# EAGLE design turntable (EAGLE 9.6.0)
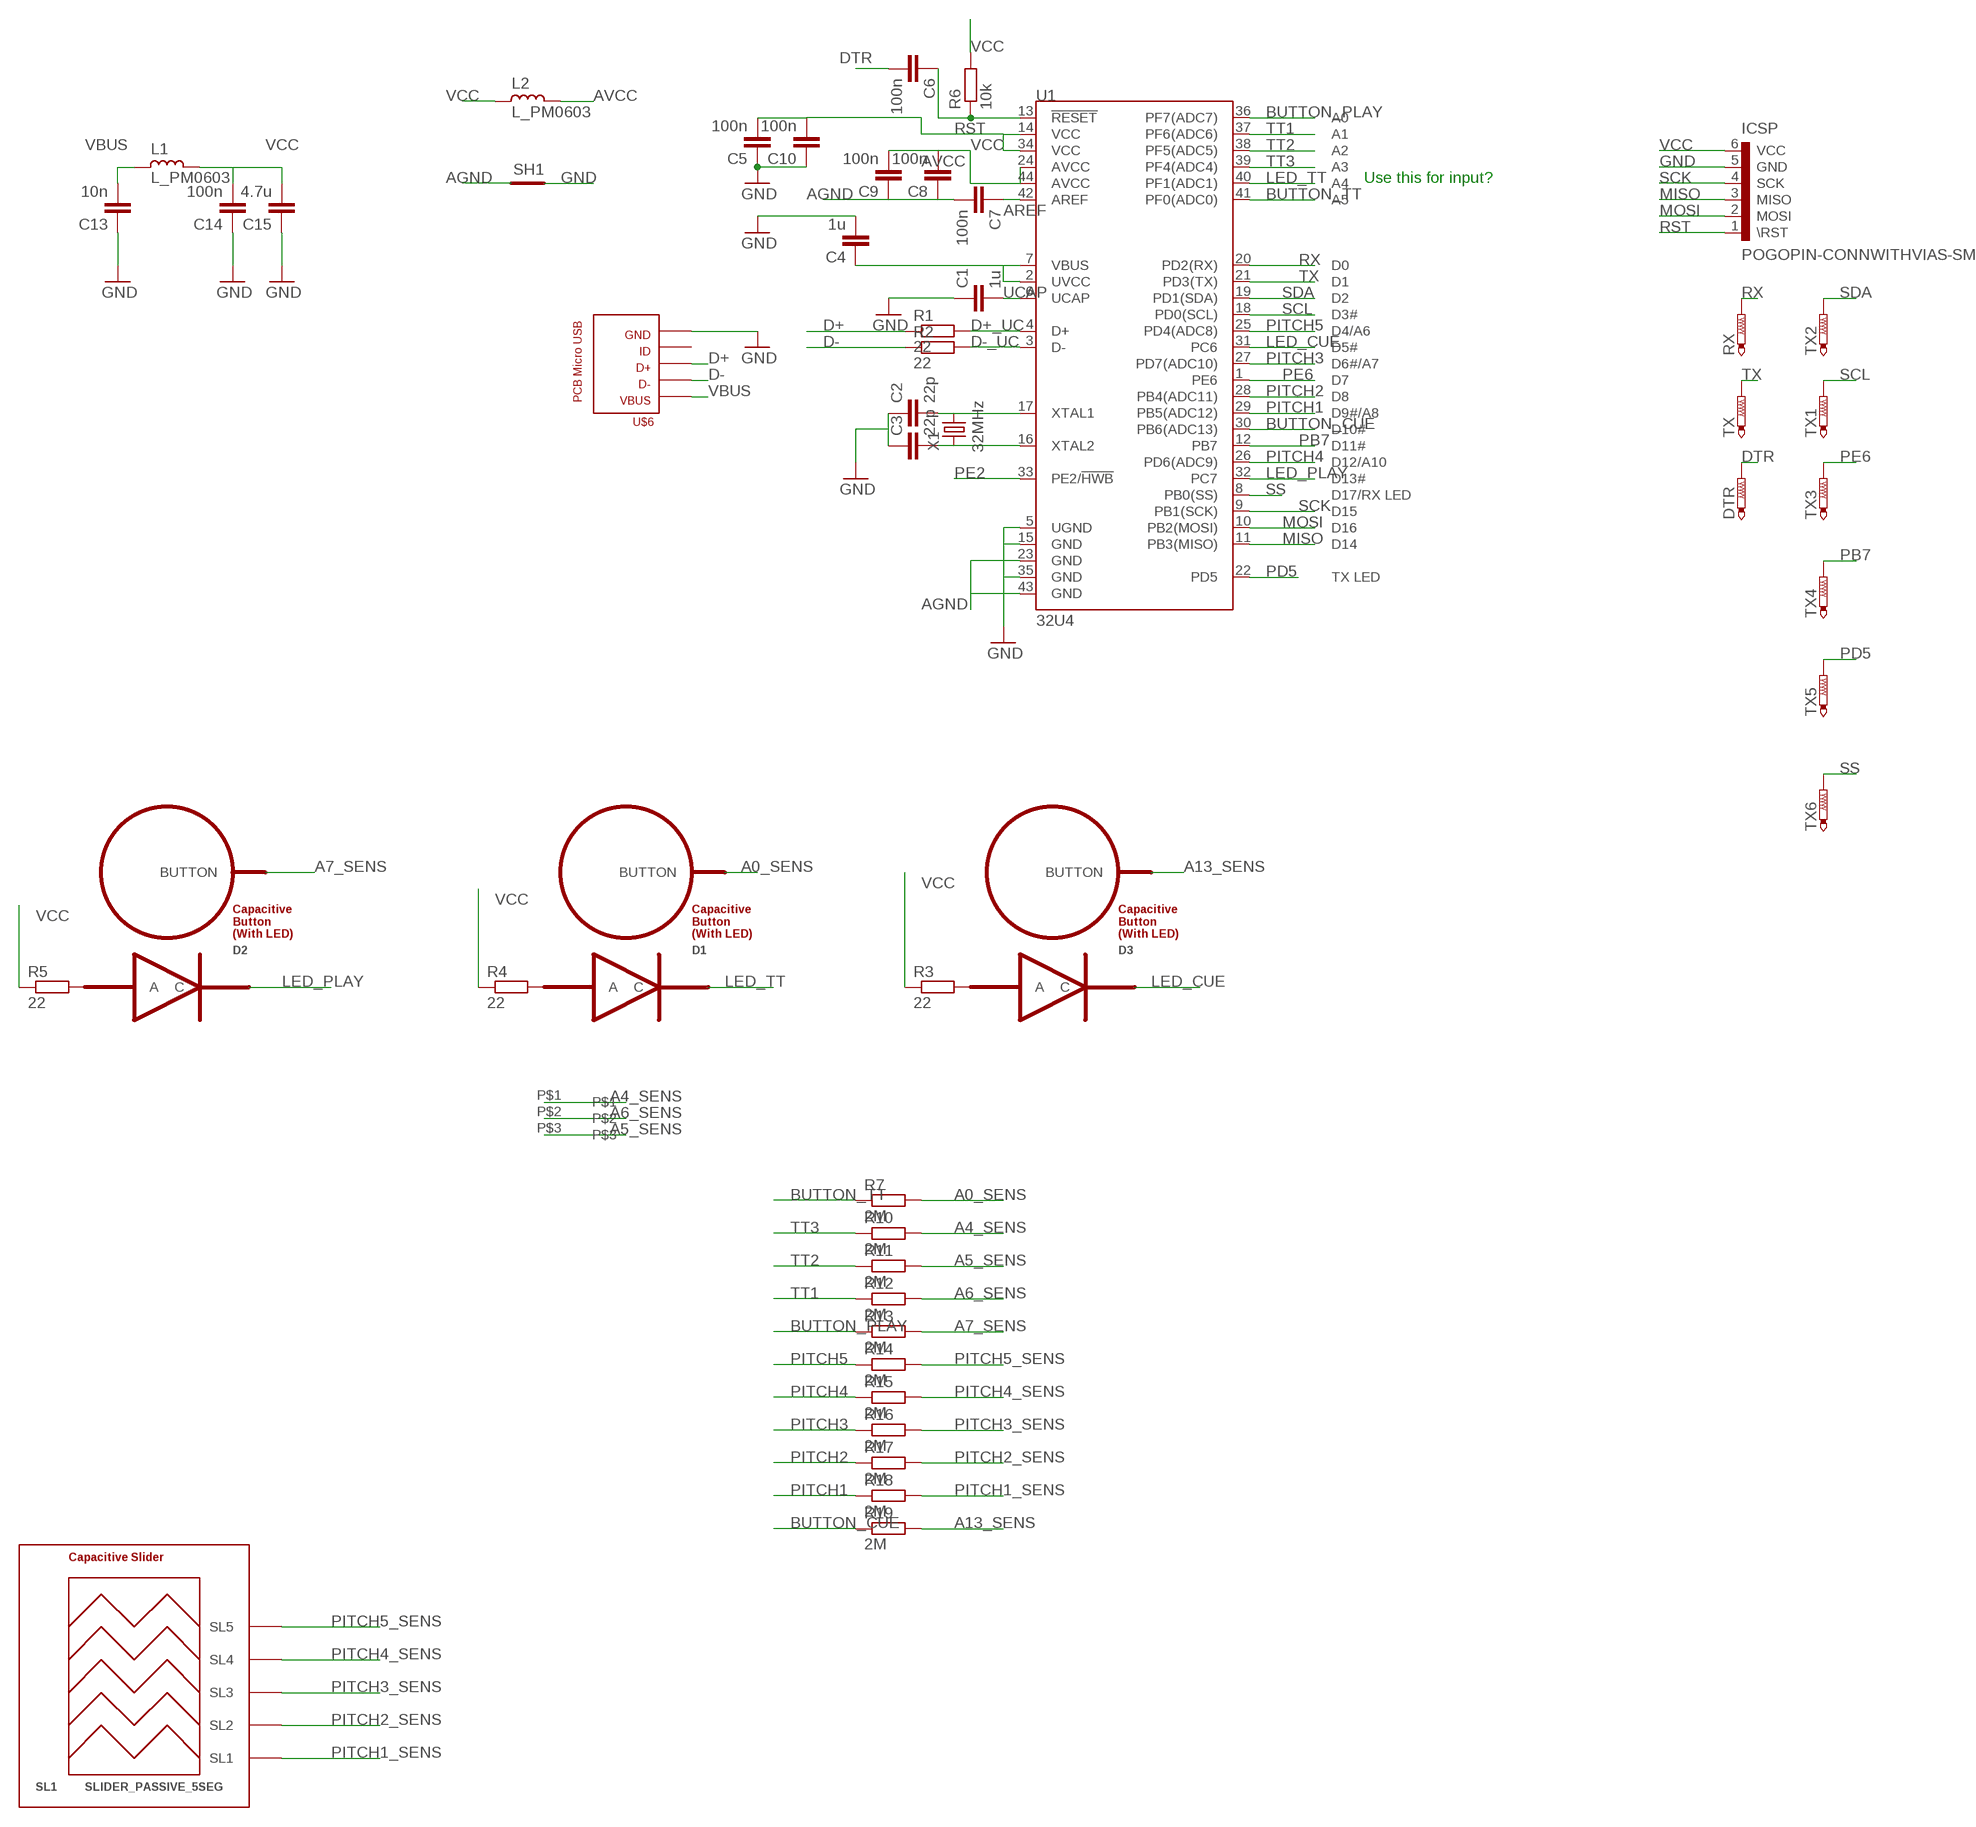
[diagram p0: schematic, sheet 1]

## Parts
C1  1u  C-EUC0402  [C0402]
C2  22p  C-EUC0402  [C0402]
C3  22p  C-EUC0402  [C0402]
C4  1u  C-EUC0402  [C0402]
C5  100n  C-EUC0402  [C0402]
C6  100n  C-EUC0402  [C0402]
C7  100n  C-EUC0402  [C0402]
C8  100n  C-EUC0402  [C0402]
C9  100n  C-EUC0402  [C0402]
C10  100n  C-EUC0402  [C0402]
C13  10n  C-EUC0402  [C0402]
C14  100n  C-EUC0402  [C0402]
C15  4.7u  C-EUC0402  [C0402]
D1  LED_BUTTON  [LED_BUTTON]
D2  LED_BUTTON  [LED_BUTTON]
D3  LED_BUTTON  [LED_BUTTON]
DTR  PTR1TP06R  [TP06R]
ICSP  POGOPIN-CONNWITHVIAS-SMV  [POGOPROG-CONN-OH-SMALLERVIAS]
L1  L_PM0603  [PM0603]
L2  L_PM0603  [PM0603]
R1  22  R-EU_R0402  [R0402]
R2  22  R-EU_R0402  [R0402]
R3  22  R-EU_R0402  [R0402]
R4  22  R-EU_R0402  [R0402]
R5  22  R-EU_R0402  [R0402]
R6  10k  R-EU_R0402  [R0402]
R7  2M  R-EU_R0402  [R0402]
R10  2M  R-EU_R0402  [R0402]
R11  2M  R-EU_R0402  [R0402]
R12  2M  R-EU_R0402  [R0402]
R13  2M  R-EU_R0402  [R0402]
R14  2M  R-EU_R0402  [R0402]
R15  2M  R-EU_R0402  [R0402]
R16  2M  R-EU_R0402  [R0402]
R17  2M  R-EU_R0402  [R0402]
R18  2M  R-EU_R0402  [R0402]
R19  2M  R-EU_R0402  [R0402]
RX  PTR1TP06R  [TP06R]
SH1  SHORT  [SHORT_TOP-6]
SL1  SLIDER_PASSIVE_5SEG  [SLIDER_PASSIVE_5SEG_12MM]
TX  PTR1TP06R  [TP06R]
TX1  PTR1TP06R  [TP06R]
TX2  PTR1TP06R  [TP06R]
TX3  PTR1TP06R  [TP06R]
TX4  PTR1TP06R  [TP06R]
TX5  PTR1TP06R  [TP06R]
TX6  PTR1TP06R  [TP06R]
U1  32U4  ATMEGA32U4QFN  [QFN-44]
U$1  TURNTABLE  [TURNTABLE]
U$6  PCB_MICRO_USB_BSS_2  [USB_TYPE_B_SS_2]
X1  32MHz  CRYSTAL-32MHZ-SMD-2.0X1.6MM  [CRYSTAL-SMD-2.0X1.6MM]

## Nets
A0_SENS: D1.BUTTON R7.2
A4_SENS: R10.2 U$1.P$1
A5_SENS: R11.2 U$1.P$3
A6_SENS: R12.2 U$1.P$2
A7_SENS: D2.BUTTON R13.2
A13_SENS: D3.BUTTON R19.2
AGND: C7.2 C8.1 C9.1 SH1.1 U1.23(GND) U1.43(GND)
AREF: C7.1 U1.42(AREF)
AVCC: C8.2 C9.2 L2.1 U1.24(AVCC) U1.44(AVCC)
BUTTON_CUE: R19.1 U1.30(PB6(ADC13))
BUTTON_PLAY: R13.1 U1.36(PF7(ADC7))
BUTTON_TT: R7.1 U1.41(PF0(ADC0))
D+: R1.1 U$6.3
D+_UC: R1.2 U1.4(D+)
D-: R2.1 U$6.2
D-_UC: R2.2 U1.3(D-)
DTR: C6.2 DTR.TP
GND: C1.1 C2.1 C3.1 C4.2 C5.1 C10.1 C13.1 C14.1 C15.1 ICSP.5(GND) SH1.2 U1.5(UGND) U1.15(GND) U1.35(GND) U$6.5
LED_CUE: D3.C U1.31(PC6)
LED_PLAY: D2.C U1.32(PC7)
LED_TT: D1.C U1.40(PF1(ADC1))
MISO: ICSP.3(MISO) U1.11(PB3(MISO))
MOSI: ICSP.2(MOSI) U1.10(PB2(MOSI))
N$6: D3.A R3.2
N$7: C2.2 U1.17(XTAL1) X1.3
N$8: C3.2 U1.16(XTAL2) X1.1
N$9: D1.A R4.2
N$10: D2.A R5.2
PB7: TX4.TP U1.12(PB7)
PD5: TX5.TP U1.22(PD5)
PE2: U1.33(PE2/!HWB)
PE6: TX3.TP U1.1(PE6)
PITCH1: R18.1 U1.29(PB5(ADC12))
PITCH1_SENS: R18.2 SL1.SL1
PITCH2: R17.1 U1.28(PB4(ADC11))
PITCH2_SENS: R17.2 SL1.SL2
PITCH3: R16.1 U1.27(PD7(ADC10))
PITCH3_SENS: R16.2 SL1.SL3
PITCH4: R15.1 U1.26(PD6(ADC9))
PITCH4_SENS: R15.2 SL1.SL4
PITCH5: R14.1 U1.25(PD4(ADC8))
PITCH5_SENS: R14.2 SL1.SL5
RST: C6.1 ICSP.1(\RST) R6.1 U1.13(!RESET)
RX: RX.TP U1.20(PD2(RX))
SCK: ICSP.4(SCK) U1.9(PB1(SCK))
SCL: TX1.TP U1.18(PD0(SCL))
SDA: TX2.TP U1.19(PD1(SDA))
SS: TX6.TP U1.8(PB0(SS))
TT1: R12.1 U1.37(PF6(ADC6))
TT2: R11.1 U1.38(PF5(ADC5))
TT3: R10.1 U1.39(PF4(ADC4))
TX: TX.TP U1.21(PD3(TX))
UCAP: C1.2 U1.6(UCAP)
VBUS: C13.2 L1.2 U$6.1
VCC: C4.1 C5.2 C10.2 C14.2 C15.2 ICSP.6(VCC) L1.1 L2.2 R3.1 R4.1 R5.1 R6.2 U1.2(UVCC) U1.7(VBUS) U1.14(VCC) U1.34(VCC)
Unconnected: U$6.4

## Notes on the sheet
- Use this for input?

## Library data of the parts
C1-C10 C13-C15 = rcl:C-EU: CAPACITOR, European symbol; SPICEPREFIX: C
D1-D3 = credit_card_midi:LED_BUTTON
DTR RX TX TX1-TX6 = testpad:PTR1: TEST PIN
ICSP = Protofusion:POGOPIN-CONN: Protofusion custom pogo pin programming header
L1 L2 = rc-master-smd:L_: INDUCTOR
R1-R7 R10-R19 = rcl:R-EU_: RESISTOR, European symbol; SPICEPREFIX: R
SH1 = shorts:SHORT: Short between two nets
SL1 = credit_card_midi:SLIDER_PASSIVE_5SEG: Slider, Passive Touch/Capacitive Sensing Type, Five (5) Segment Source : http://www.PatternAgents.com Github : https://github.com/PatternAgents License : http://creativecommons.org/licenses/by-sa/3.1/ (Creative Commons 3.1) THIS SOFTWARE IS PROVIDED BY THE CONTRIBUTORS "AS IS" AND WITHOUT ANY EXPRESS OR IMPLIED WARRANTIES, INCLUDING, BUT NOT LIMITED TO, THE IMPLIED WARRANTIES OF MERCHANTABILITY AND FITNESS FOR A PARTICULAR PURPOSE ARE DISCLAIMED. IN NO EVENT SHALL THE COPYRIGHT OWNER OR CONTRIBUTORS BE LIABLE FOR ANY DIRECT, INDIRECT, INCIDENTAL, SPECIAL, EXEMPLARY, OR CONSEQUENTIAL DAMAGES (INCLUDING, BUT NOT LIMITED TO, PROCUREMENT OF SUBSTITUTE GOODS OR SERVICES; LOSS OF USE, DATA, OR PROFITS; OR BUSINESS INTERRUPTION) HOWEVER CAUSED AND ON ANY THEORY OF LIABILITY, WHETHER IN CONTRACT, STRICT LIABILITY, OR TORT (INCLUDING NEGLIGENCE OR OTHERWISE) ARISING IN ANY WAY OUT OF THE USE OF THIS SOFTWARE, EVEN IF ADVISED OF THE POSSIBILITY OF SUCH DAMAGE.
U1 = SparkFun-IC-Microcontroller:ATMEGA32U4: Atmel MCU, 32KByte Atmel 44-pin 8-bit Microcontroller with 32KBytes of ISP Flash and USB Controller Datasheet <http://cdn.sparkfun.com/datasheets/Dev/Arduino/Boards/ATMega32U4.pdf> SparkFun Products LilyPad Arduino USB - ATmega32U4 Board <https://www.sparkfun.com/products/12049> (DEV-12049) Pro Micro - 5V/16MHz <https://www.sparkfun.com/products/12640> (DEV-12640) Pro Micro - 3.3V/8MHz <https://www.sparkfun.com/products/12587> (DEV-12587) Fio v3 - ATmega32U4 <https://www.sparkfun.com/products/11520> (DEV-11520) Qduino Mini <https://www.sparkfun.com/products/13614> (DEV-13614) Makey Makey - Standard Kit <https://www.sparkfun.com/products/11511> (WIG-11511) Makey Makey Deluxe Kit <https://www.sparkfun.com/products/11519> (WIG-11519); PROD_ID: IC-10828
U$1 = credit_card_midi:TURNTABLE
U$6 = USB_pcb_connectors:PCB_MICRO_USB_B
X1 = SparkFun-Clocks:CRYSTAL-32MHZ: 32MHz Crystal Digikey Example <http://www.digikey.com/product-detail/en/murata-electronics-north-america/XRCGB32M000F2P00R0/490-9769-1-ND/4952013> Frequency: 32MHz Frequency Stability: ±20ppm Frequency Tolerance: ±20ppm Load Capacitance: 6pF SparkFun Products SparkFun nRF52832 Breakout <https://www.sparkfun.com/products/13990>; PROD_ID: XTAL-13459

## Board
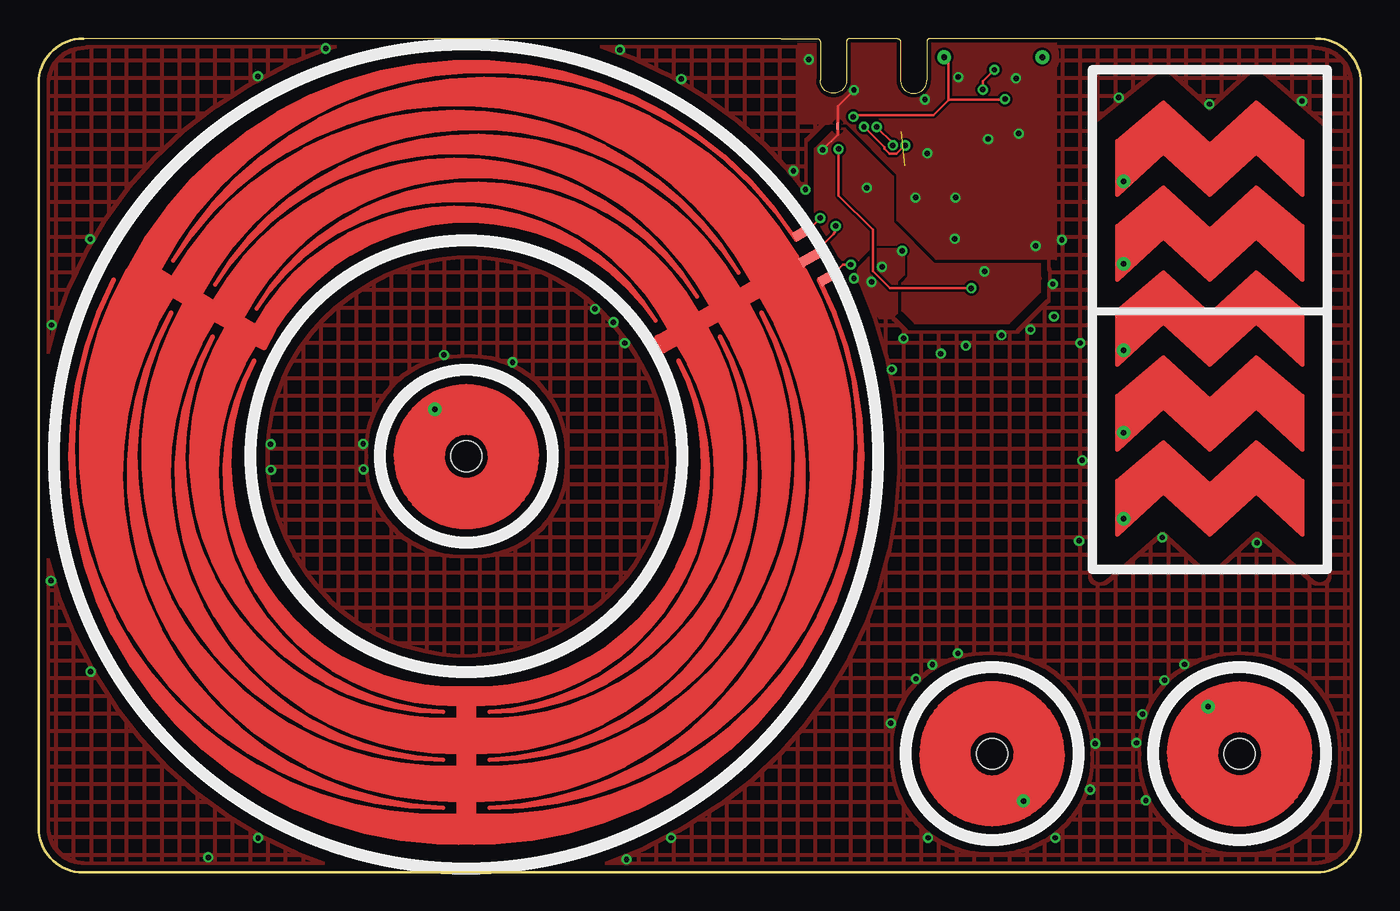
[diagram p1: board, top side]
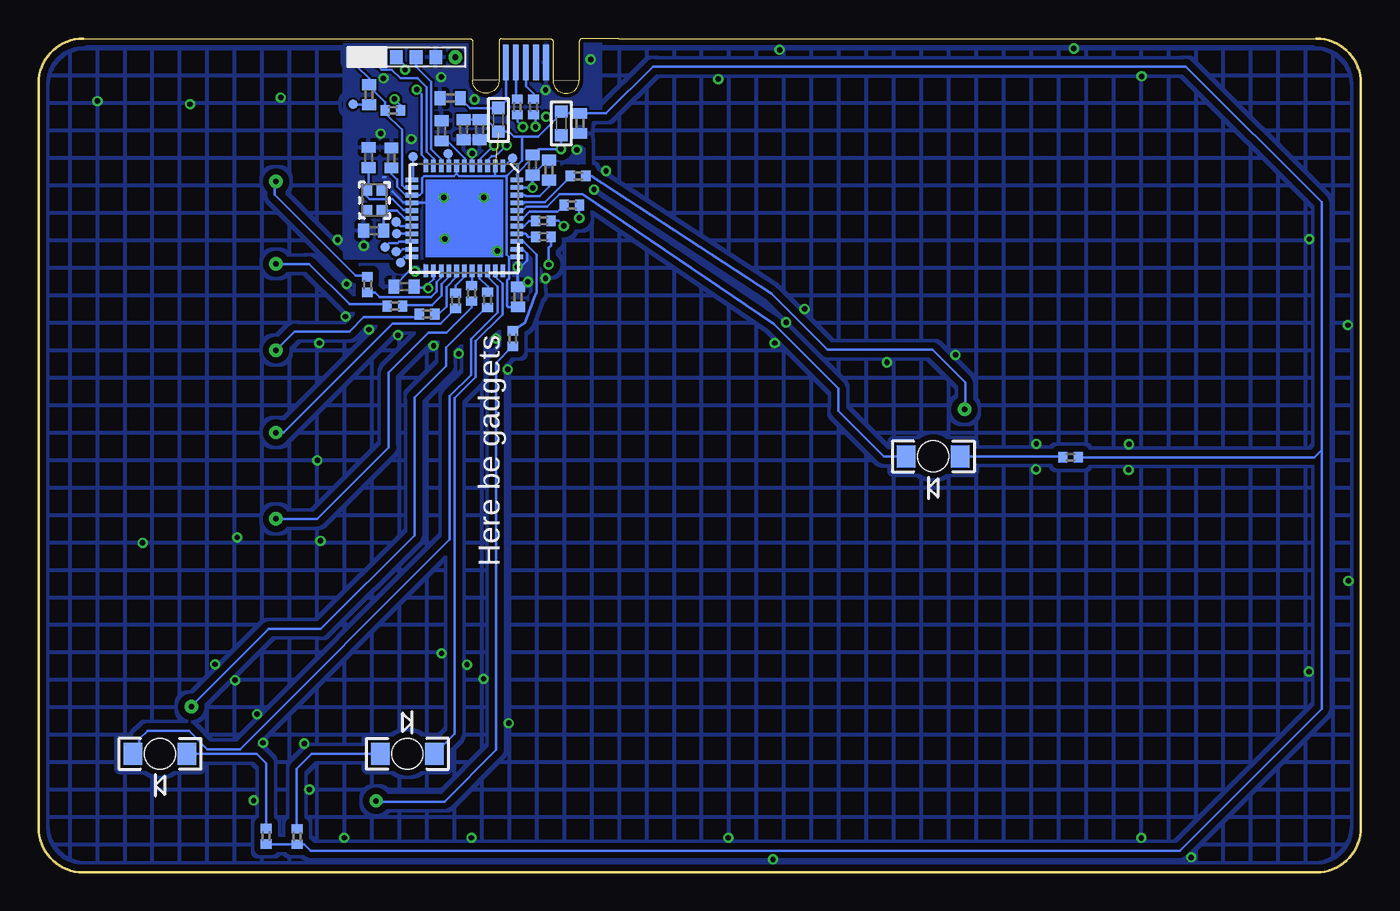
[diagram p2: board, bottom side, seen from below]

Size 85.6 x 53.98 mm. Coordinates in mm from the lower left corner, seen from the top.
Outline: 60.05,53.98 82.72,53.98 arc-90 85.6,51.1 85.6,2.88 arc-90 82.72,0 2.88,0 arc-90 0,2.88 0,51.1 arc-90 2.88,53.98 48.06,53.98
Copper layers (1*16): Top 0.035mm / dielectric 1.5mm / Bottom 0.035mm
Design rules "SeeedStudio_2layer_DRU_no_angle_20140221": minimum track width 6mil, minimum drill 12mil, track to track 6mil, track to pad 6mil, pad to pad 6mil, via to via 6mil, smd to smd 0mil, copper to edge 10mil, drill to drill 10mil, minimum pad ring 10mil, minimum via ring 6mil, stop-mask expansion 2mil, vias tented up to drill 100mil, thermal gap 10mil

### Footprints (pad centres in the part's own frame; a part is rotated, then mirrored left to right if it is on the bottom)
C0402 = smd 0.7 x 0.9: 1 -0.65,0; 2 0.65,0
LED_BUTTON = smd 1.2 x 1.4 bottom: A -1.754,0; C 1.754,0 | drill 0.356: BUTTON -2.032,3.048 | hole 2: 0,0
TP06R = smd 0.6 x 0.6: TP 0,0
POGOPROG-CONN-OH-SMALLERVIAS = drill 0.381: 1 0,2.54; 6 0,-3.81 | smd 0.889 x 0.813: 2 0,1.27; 3 0,0; 4 0,-1.27; 5 0,-2.54
PM0603 = smd 0.8 x 0.8: 1 -0.762,0; 2 0.762,0
R0402 = smd 0.6 x 0.7: 1 -0.5,0; 2 0.5,0
SHORT_TOP-6 = smd 0.305 x 0.152: 1 0.051,0; 2 -0.076,0
SLIDER_PASSIVE_5SEG_12MM = drill 0.356: SL1 -5.588,-13.462; SL2 -5.588,-7.874; SL3 -5.588,-2.54; SL4 -5.588,3.048; SL5 -5.588,8.382
QFN-44 = smd 0.8 x 0.3: 1 -3.4,2.5; 2 -3.4,2; 3 -3.4,1.5; 4 -3.4,1; 5 -3.4,0.5; 6 -3.4,0; 7 -3.4,-0.5; 8 -3.4,-1; 9 -3.4,-1.5; 10 -3.4,-2; 11 -3.4,-2.5; 23 3.4,-2.5; 24 3.4,-2; 25 3.4,-1.5; 26 3.4,-1; 27 3.4,-0.5; 28 3.4,0; 29 3.4,0.5; 30 3.4,1; 31 3.4,1.5; 32 3.4,2; 33 3.4,2.5 | smd 0.3 x 0.8: 12 -2.5,-3.4; 13 -2,-3.4; 14 -1.5,-3.4; 15 -1,-3.4; 16 -0.5,-3.4; 17 0,-3.4; 18 0.5,-3.4; 19 1,-3.4; 20 1.5,-3.4; 21 2,-3.4; 22 2.5,-3.4; 34 2.5,3.4; 35 2,3.4; 36 1.5,3.4; 37 1,3.4; 38 0.5,3.4; 39 0,3.4; 40 -0.5,3.4; 41 -1,3.4; 42 -1.5,3.4; 43 -2,3.4; 44 -2.5,3.4
TURNTABLE = smd 0.635 x 1.27: P$1 -1.679,26.126; P$2 1.669,26.126; P$3 -0.02,25.651
USB_TYPE_B_SS_2 = smd 0.37 x 2.3: 1 -1.3,-1.55; 2 -0.65,-1.55; 3 0,-1.55; 4 0.65,-1.55; 5 1.3,-1.55
CRYSTAL-SMD-2.0X1.6MM = smd 0.75 x 0.7: 1 -0.675,-0.5; 2 0.675,-0.5; 3 0.675,0.5; 4 -0.675,0.5

### Placement (x,y rotation side)
C1  59.51,48.01 270 bottom
C2  63.91,41.55 0 bottom
C3  64.24,46.28 270 bottom
C4  50.55,48.49 270 bottom
C5  62.76,46.25 270 bottom
C6  64.21,50.34 270 bottom
C7  52.55,45.47 90 bottom
C8  61.95,37.92 0 bottom
C9  53.62,45.8 90 bottom
C10  54.57,37.26 270 bottom
C13  58.95,50.11 0 bottom
C14  58.09,48.08 90 bottom
C15  57.05,48.08 90 bottom
D1  27.69,26.92 0 top
D2  61.72,7.67 180 top
D3  77.75,7.67 0 top
DTR  65.25,49.73 0 bottom
ICSP  62.43,52.78 90 bottom
L1  55.83,48.72 90 bottom
L2  51.77,48.49 90 bottom
R1  53.57,49.56 270 bottom
R2  54.61,49.56 270 bottom
R3  70.87,2.34 90 bottom
R4  18.8,26.87 180 bottom
R5  68.86,2.31 90 bottom
R6  62.66,49.33 0 bottom
R7  50.67,45.09 0 bottom
R10  51.08,43.21 0 bottom
R11  52.93,42.18 0 bottom
R12  52.93,41.15 0 bottom
R13  54.9,34.56 270 bottom
R14  64.31,38.05 90 bottom
R15  62.53,36.65 180 bottom
R16  60.45,36.14 180 bottom
R17  58.6,37.01 270 bottom
R18  57.57,37.49 270 bottom
R19  56.54,37.07 270 bottom
RX  63.17,40.49 0 bottom
SH1  51.74,48.27 270 top
SL1  75.82,36.35 0 top
TX  62.46,40.18 0 bottom
TX1  62.46,42.11 0 bottom
TX2  62.43,41.35 0 bottom
TX3  54.91,46.25 0 bottom
TX4  61.37,46.33 0 bottom
TX5  62.18,39.47 0 bottom
TX6  59.11,46.53 0 bottom
U1  58.04,42.34 270 bottom
U$1  27.69,26.92 300 top
U$6  54.05,53.98 0 bottom
X1  63.86,43.51 270 bottom

### Tracks (layer width: path | path; a pad name or v marks a point on that pad's centre or on a via)
A0_SENS
  Bottom 0.152: D1.BUTTON 25.6,30.02 25.6,31.7 27.74,33.83 34.54,33.83 38.17,37.46 49.81,45.09 R7.2
A4_SENS  (via drill 0.35)
  Top 0.152: v50.6,42.37 49.78,41.55 49.66,41.55 49.58,41.55 U$1.P$1
  Bottom 0.152: R10.2 50.6,43.19 v50.6,42.37
A5_SENS  (via drill 0.35)
  Top 0.152: v51.6,41.85 51.6,41.56 51.46,41.34 U$1.P$3
  Bottom 0.152: R11.2 52.41,42.2 51.96,42.2 v51.6,41.85
A6_SENS  (via drill 0.35)
  Top 0.152: v52.58,39.34 52.07,39.34 51.28,38.56 51.26,38.56 51.2,38.59 U$1.P$2
  Bottom 0.152: v52.58,39.34 52.58,40.44 52.43,40.58 R12.2
A7_SENS
  Bottom 0.152: D2.BUTTON 63.7,4.57 59.33,4.57 55.98,7.92 55.98,32.98 R13.2
A13_SENS
  Bottom 0.152: R19.2 56.63,36.57 59.22,33.98 59.22,32.79 61.27,30.75 61.27,21.82 67.33,15.75 70.71,15.75 75.72,10.74 D3.BUTTON
AGND  (via drill 0.35)
  Top 0.152: SH1.1 51.74,47.76 v50.76,46.78
  Bottom 0.152: U1.43 54.62,44.33 v53.62,44.33 C9.1 52.65,46.12 C7.2 | v61.24,38.91 61.61,38.91 C8.1
  pour Bottom (isolate 0.406): 64.82,38.38 64.82,37.57 62.81,35.56 56.72,35.56 55.91,36.37 55.91,38.15 56.31,38.56 56.31,40.64 54.08,40.64 53.06,39.62 52.04,39.62 50.27,41.4 50.27,46.86 50.88,47.47 52.86,47.47 55.3,45.03 55.3,42.09 57.99,39.4 64.83,39.4 64.82,39.38 64.82,38.53 64.9,38.45
  pour Top: 64.82,38.38 64.82,37.57 62.81,35.56 56.72,35.56 55.91,36.37 55.91,38.15 56.31,38.56 56.31,40.64 54.08,40.64 53.06,39.62 52.04,39.62 50.27,41.4 50.27,46.86 51.54,48.13 52.2,48.13 55.3,45.03 55.3,42.09 57.99,39.4 64.83,39.4 64.82,39.38 64.82,38.53 64.9,38.45
AREF
  Bottom 0.152: U1.42 54.15,43.84 54.08,43.77 53.18,43.77 52.55,44.4 C7.1
AVCC  (via drill 0.35)
  Top 0.152: v51.79,46.83 51.79,43.83 54.01,41.6 54.01,38.93 55.12,37.82 v60.38,37.82
  Bottom 0.152: U1.44 54.64,45.25 53.62,46.27 C9.2 53.23,46.83 v51.79,46.83 51.79,47.73 L2.1 | U1.24 60.04,38.42 60.38,38.08 60.38,37.85 | 60.38,37.85 v60.38,37.82 | C8.2 61.22,37.85 60.38,37.85
BUTTON_CUE
  Bottom 0.152: U1.30 57.04,38.45 56.51,37.91 56.51,37.6 R19.1
BUTTON_PLAY
  Bottom 0.152: U1.36 54.21,40.84 53.35,39.98 53.35,37.5 53.43,37.43 54.11,35.61 R13.1
BUTTON_TT
  Bottom 0.152: U1.41 54.19,43.34 54.13,43.4 52.83,43.4 51.17,45.06 R7.1
D+
  Bottom 0.152: R1.1 53.57,50.41 54.05,50.89 U$6.3
D+_UC  (via drill 0.35)
  Top 0.152: v56.11,47.07 56.08,47.07 55.53,46.52 55.07,46.52 54.74,46.84 54.74,46.95 v53.43,48.27
  Bottom 0.152: U1.4 57.04,46.14 v56.11,47.07 | v53.43,48.27 53.44,48.28 53.44,48.93 R1.2
D-
  Bottom 0.152: R2.1 54.69,50.13 54.69,52.41 U$6.2
D-_UC  (via drill 0.35)
  Top 0.152: v54.25,48.26 55.3,47.21 v55.3,47.08
  Bottom 0.152: U1.3 56.55,46.11 56.28,46.37 56.01,46.37 v55.3,47.08 | R2.2 54.61,48.62 v54.25,48.26
DTR
  Bottom 0.152: C6.2 64.95,49.69 64.99,49.73 DTR.TP
GND  (via drill 0.35)
  Top 0.152: SH1.2 51.74,49.61 v52.78,50.65
  Bottom 0.152: U1.5 v57.54,46.55 v57.53,46.56 | 63.15,45.02 63.31,45.02 | 62.69,44.06 62.01,43.39 61.48,43.39 U1.15 61.46,43.36 59.69,43.36 v59.36,43.69 | C10.1 54.6,37.94 v54.6,39.2 54.5,39.1 53.99,39.61 53.99,40.07 54.26,40.34 U1.35
  other vias: 63.45,47.83 59.54,51.49 64.54,40.56 40.94,2.24 57.58,2.24 56.79,12.52 61.47,47.47 62.33,34.77 60.03,34.1 58.41,33.58 64.21,35.14 65.74,35.98 65.66,38.09 78.87,21.34 81.79,49.94 14.2,51.54 3.34,41 0.8,18.87 14.21,2.22 72.75,21.68 67.56,26.67 67.44,34.26 66.24,40.94 69.93,50.16 75.79,49.73 3.37,12.99 10.99,0.97 0.84,35.43 18.59,53.34 57.86,13.44 55.17,9.65 67.36,21.46 65.81,2.24 71.68,4.65 68.07,5.36 68.4,8.33 71.07,8.38 37.63,53.25 48.87,45.42 41.61,51.36 15.04,26.06 15.01,27.71 36.02,36.47 37.21,35.61 37.95,34.26 21.03,26.09 21.01,27.74 26.24,33.5 30.68,33.02 56.77,43.69 59.51,14.17 52.78,38.46 59.31,41.02 55.91,40.23 63.27,51.41 49.86,52.63 55.99,34.57 57.38,50.04 49.64,44.21 53.92,38.23 72.89,12.43 74.18,13.46 38.06,0.84 55.23,32.56 71.46,10.24
  pour Top (isolate 0.406, rank 2, hatched): -2.77,56.59 -2.77,-3.02 88.19,-3.02 88.19,56.59
  pour Bottom (isolate 0.406, rank 2, hatched): -2.77,56.46 -2.77,-3.12 88.19,-3.12 88.19,56.46
  pour Top: 49.19,54.01 49.19,48.49 52.29,48.49 55.6,45.17 55.6,42.21 58.07,39.74 65.86,39.71 65.86,54.28 63.6,56.54 51.71,56.54
  pour Bottom: 49.19,54.01 49.19,48.49 52.29,48.49 55.6,45.17 55.6,42.21 58.07,39.74 65.84,39.71 65.84,54.33 63.63,56.54 51.71,56.54
  pour Top: 54.27,40.34 56.01,40.34 56.01,38.68 55.58,38.25 55.58,36.2 55.27,35.89 54.43,35.89 53.9,36.42 53.9,37.39 53.04,38.25 53.04,39.1
  pour Bottom: 54.25,40.31 56.01,40.31 56.01,38.68 55.58,38.25 55.58,36.2 55.27,35.89 54.43,35.89 53.9,36.42 53.9,37.39 53.04,38.25 53.04,39.1
LED_CUE
  Bottom 0.152: U1.31 56.54,38.56 55.89,37.91 55.89,36.23 57.61,34.52 57.61,32.21 58.98,30.84 58.98,21.57 72.57,7.98 74.68,7.98 75.87,9.17 78.55,9.17 79.08,8.64 79.08,8.1 D3.C
LED_PLAY
  Bottom 0.152: U1.32 56.04,38.56 55.58,38.1 55.58,36.11 57.3,34.39 57.3,32.08 58.67,30.71 58.67,8.96 D2.C
LED_TT
  Bottom 0.152: U1.40 54.26,42.84 54,43.1 52.69,43.1 51.87,43.92 50.38,43.92 38,35.48 33.83,31.32 33.83,29.87 30.89,26.92 D1.C
MISO  (via drill 0.35)
  Top 0.152: v61.88,51.97 61.13,51.22 v61.13,50.68
  Bottom 0.152: U1.11 60.54,46.17 60.82,46.46 60.82,50.38 v61.13,50.68 | ICSP.3 61.88,52.23 v61.88,51.97
MOSI
  Bottom 0.152: ICSP.2 63.7,52.27 63.4,51.97 62.74,51.97 62.18,51.41 61.07,51.41 60.49,50.84 60.49,46.65 60.04,46.2 U1.10
N$6
  Bottom 0.152: D3.A 71.48,7.67 70.87,7.06 R3.2
N$7
  Bottom 0.152: U1.17 61.91,42.34 62.41,42.84 X1.3 63.36,42.73 63.31,42.69 63.26,42.67 C2.2
N$8
  Bottom 0.152: C3.2 64.24,44.4 64.36,44.28 X1.1 64.36,43.78 64.16,43.58 62.67,43.58 61.96,42.87 61.46,42.87 U1.16
N$9
  Bottom 0.152: R4.2 19.65,26.92 D1.A
N$10
  Bottom 0.152: D2.A 67.92,7.67 68.89,6.71 68.89,3.19 R5.2
PB7
  Bottom 0.152: U1.12 61.37,44.91 TX4.TP
PD5
  Bottom 0.152: TX5.TP 62.18,39.61 61.95,39.84 U1.22
PE6
  Bottom 0.152: TX3.TP 55.43,45.74 U1.1
PITCH1
  Bottom 0.152: R18.1 57.54,38.02 U1.29
PITCH1_SENS
  Bottom 0.152: SL1.SL1 67.56,22.89 62.94,27.51 62.94,32.35 60.34,34.95 59.19,34.95 57.57,36.56 R18.2
PITCH2
  Bottom 0.152: U1.28 58.04,38.56 58.6,38 R17.1
PITCH2_SENS
  Bottom 0.152: SL1.SL2 69.75,28.47 62.68,35.54 59.56,35.54 R17.2
PITCH3
  Bottom 0.152: U1.27 58.56,38.94 58.56,38.53 59.2,37.9 59.2,36.64 59.7,36.14 R16.1
PITCH3_SENS
  Bottom 0.152: SL1.SL3 69.01,35.03 65.48,35.03 64.55,35.95 61.14,35.95 R16.2
PITCH4
  Bottom 0.152: U1.26 59.04,38.56 59.52,38.08 59.52,37.33 60.12,36.73 61.96,36.73 R15.1
PITCH4_SENS
  Bottom 0.152: SL1.SL4 68.1,39.4 65.48,36.78 63.16,36.78 R15.2
PITCH5
  Bottom 0.152: U1.25 59.54,38.49 59.83,38.2 59.83,37.59 60.18,37.24 63.52,37.24 63.83,37.55 R14.1
PITCH5_SENS
  Bottom 0.152: SL1.SL5 70.31,44.81 70.31,43.87 65.07,38.62 64.39,38.62 R14.2
RST
  Bottom 0.152: ICSP.1 64.97,52.17 64.21,51.41 C6.1 64.23,50.94 63.16,49.88 R6.1 63.16,49.17 62.08,48.08 62.08,44.51 61.91,44.34 U1.13
RX
  Bottom 0.152: RX.TP 62.91,40.75 62.35,40.75 62.26,40.84 U1.20
SCK
  Bottom 0.152: ICSP.4 61.16,52.17 60.19,51.2 60.19,46.83 59.54,46.18 U1.9
SCL
  Bottom 0.152: U1.18 62.18,41.84 62.21,41.88 62.23,41.88 TX1.TP
SDA
  Bottom 0.152: TX2.TP U1.19
SS
  Bottom 0.152: U1.8 59.04,46.47 TX6.TP
TT1
  Bottom 0.152: R12.1 53.88,41.13 54.09,41.34 U1.37
TT2
  Bottom 0.152: U1.38 54.19,41.84 53.85,42.18 R11.1
TT3
  Bottom 0.152: U1.39 54.25,42.34 53.82,42.77 52.01,42.77 R10.1
TX
  Bottom 0.152: U1.21 62.05,40.34 62.2,40.18 TX.TP
UCAP
  Bottom 0.152: U1.6 58.04,46.25 59.14,47.36 C1.2
VBUS
  Bottom 0.152: U$6.1 55.35,49.96 L1.2 57.67,49.48 C13.2
VCC  (via drill 0.35)  (1 unrouted)
  Top 0.152: v62.56,50.07 62.51,50.01 58.9,50.01 | 58.9,50.01 58.9,52.5 ICSP.6 | v52.74,48.92 52.84,49.02 57.94,49.02 58.9,49.99 58.9,50.01
  Bottom 0.152: 2.54,27.34 3.01,26.87 R4.1 | 2.54,27.34 2.54,43.38 11.32,52.16 45.83,52.16 48.85,49.14 C4.1 51.65,49.14 L2.2 51.77,49.14 52.36,48.55 | 2.54,27.34 2.54,10.59 11.73,1.4 67.98,1.4 68.4,1.81 R5.1 70.7,1.81 70.86,1.78 R3.1 | 56,45.09 58.39,45.09 58.54,45.24 | R6.2 | R6.2 62.16,49.66 v62.56,50.07 | 56,45.09 55.29,45.09 | 54.31,47.63 54.82,47.63 55.14,47.95 L1.1 56.61,48.73 C15.2 C14.2 | 54.31,47.63 54.31,46.07 55.29,45.09 55.31,45.11 55.31,39.99 55.16,39.84 | 52.36,48.55 53.27,47.63 54.31,47.63 | C10.2 55.19,36.61 55.27,36.69 55.27,38.34 55.16,38.45 55.16,39.84 | 55.16,39.84 U1.34 | C5.2 62.75,45.21 62.38,44.84 62.38,44.38 61.81,43.81 61.47,43.81 U1.14 60.94,43.84 60.77,44.01 60.77,44.94 60.63,45.07 58.71,45.07 58.54,45.24 | 58.54,45.24 U1.7 | v52.74,48.92 52.37,48.55 52.36,48.55 | 56,45.09 56.04,45.12 U1.2

### Text on the board
bPlace: Here be gadgets